# EAGLE design MAX232 to ATMega32 (EAGLE 9.6.0)
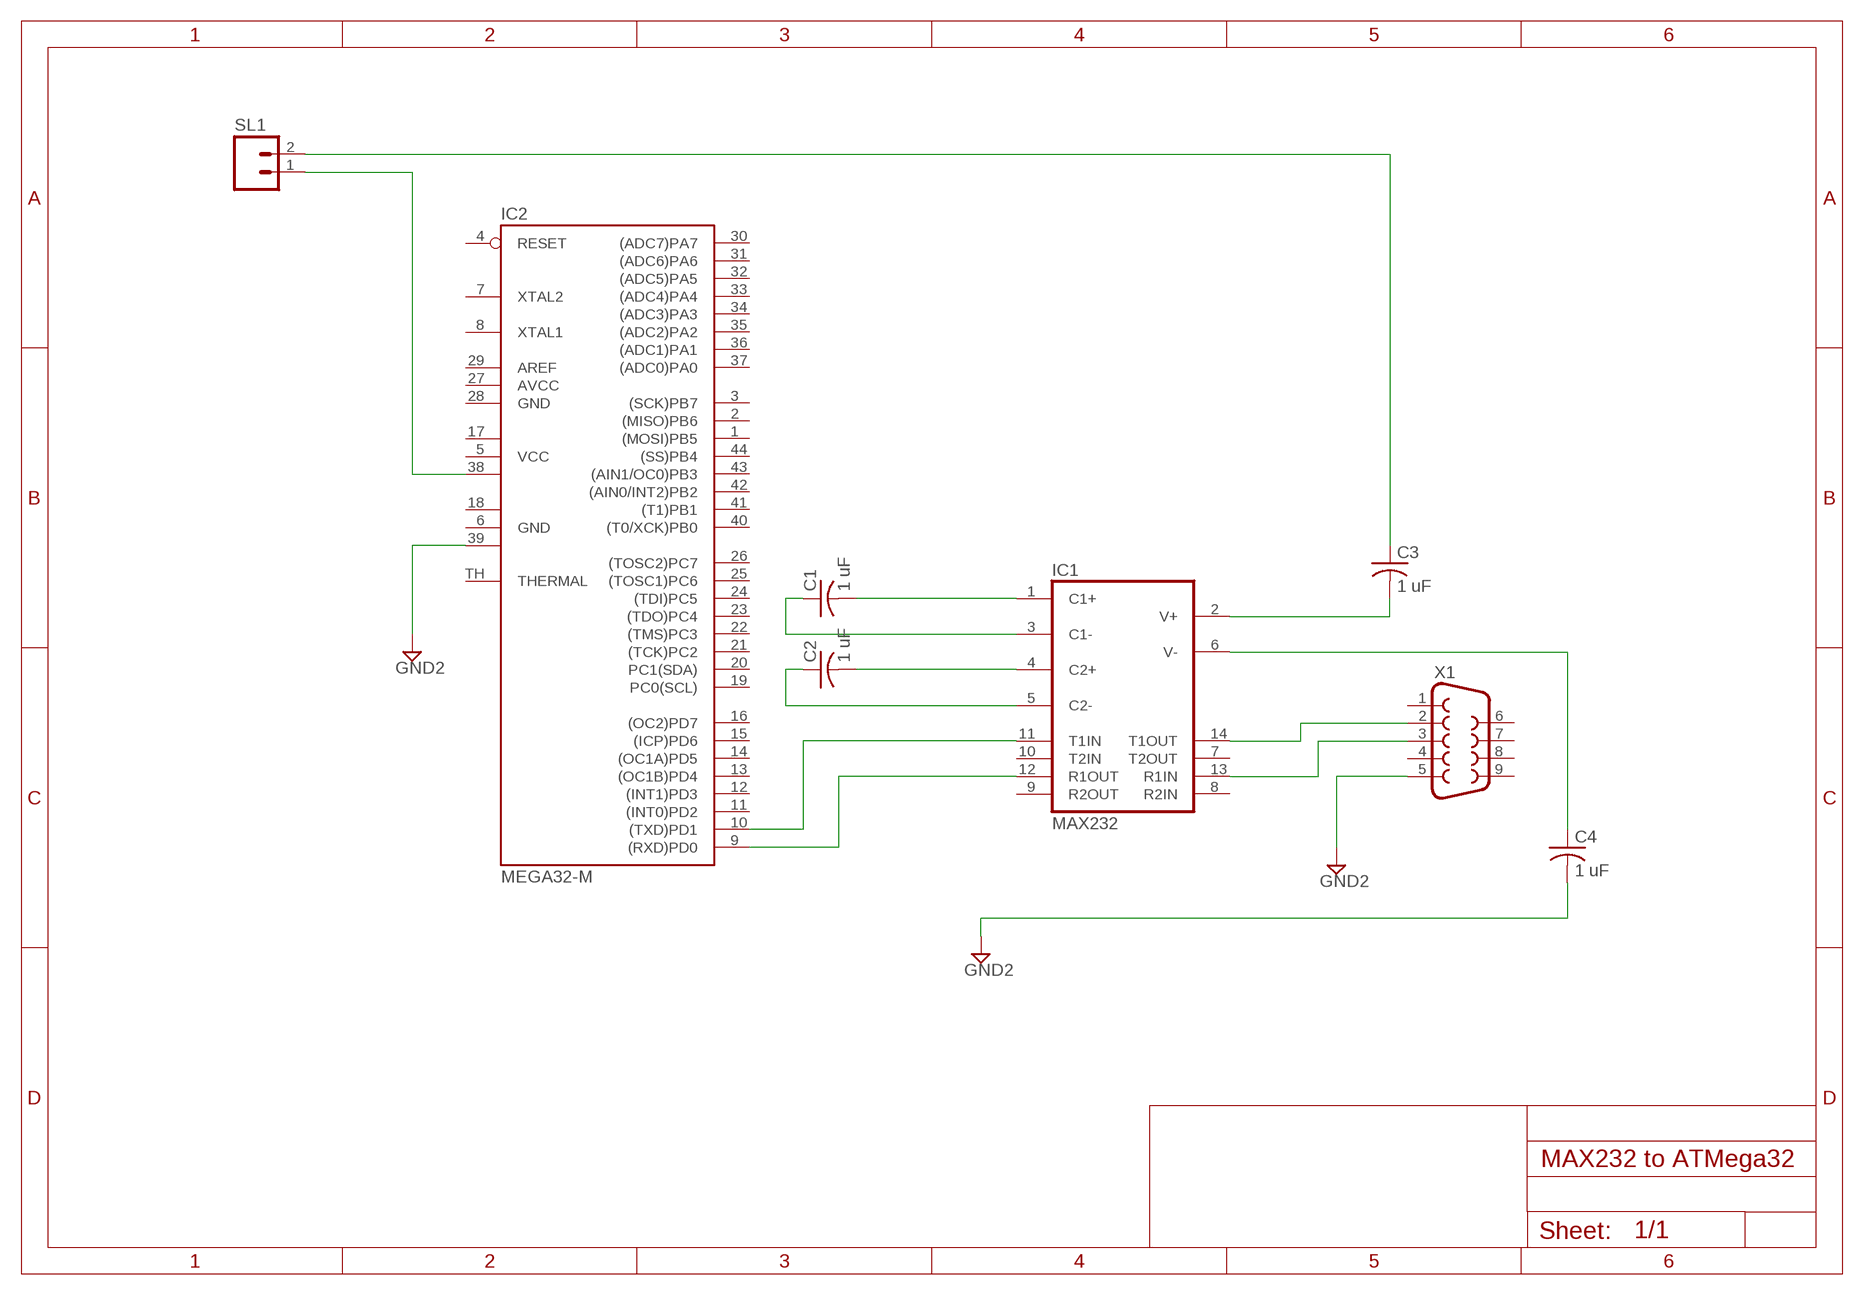
[diagram p0: schematic, sheet 1]

## Parts
C1  1 uF  C-US025-025X050  [C025-025X050]
C2  1 uF  C-US025-025X050  [C025-025X050]
C3  1 uF  C-US025-025X050  [C025-025X050]
C4  1 uF  C-US025-025X050  [C025-025X050]
IC1  MAX232  [DIL16]
IC2  MEGA32-M  [MLF44-TH]
SL1  M02  [02P]
X1  F09VB  [F09VB]

## Nets
GND2: C4.2 IC2.39(GND2) X1.5
N$1: IC1.14(T1OUT) X1.2
N$2: IC1.13(R1IN) X1.3
N$3: IC1.11(T1IN) IC2.10((TXD)PD1)
N$4: IC1.12(R1OUT) IC2.9((RXD)PD0)
N$5: C3.2 IC1.2(V+)
N$6: C4.1 IC1.6(V-)
N$7: C1.2 IC1.1(C1+)
N$8: C1.1 IC1.3(C1-)
N$9: C2.2 IC1.4(C2+)
N$10: C2.1 IC1.5(C2-)
N$12: C3.1 SL1.2
N$13: IC2.38(VCC2) SL1.1
Unconnected: IC1.7(T2OUT) IC1.8(R2IN) IC1.9(R2OUT) IC1.10(T2IN) IC2.1((MOSI)PB5) IC2.2((MISO)PB6) IC2.3((SCK)PB7) IC2.4(RESET) IC2.7(XTAL2) IC2.8(XTAL1) IC2.11((INT0)PD2) IC2.12((INT1)PD3) IC2.13((OC1B)PD4) IC2.14((OC1A)PD5) IC2.15((ICP)PD6) IC2.16((OC2)PD7) IC2.19(PC0(SCL)) IC2.20(PC1(SDA)) IC2.21((TCK)PC2) IC2.22((TMS)PC3) IC2.23((TDO)PC4) IC2.24((TDI)PC5) IC2.25((TOSC1)PC6) IC2.26((TOSC2)PC7) IC2.29(AREF) IC2.30((ADC7)PA7) IC2.31((ADC6)PA6) IC2.32((ADC5)PA5) IC2.33((ADC4)PA4) IC2.34((ADC3)PA3) IC2.35((ADC2)PA2) IC2.36((ADC1)PA1) IC2.37((ADC0)PA0) IC2.40((T0/XCK)PB0) IC2.41((T1)PB1) IC2.42((AIN0/INT2)PB2) IC2.43((AIN1/OC0)PB3) IC2.44((SS)PB4) IC2.TH(THERMAL) X1.1 X1.4 X1.6 X1.7 X1.8 X1.9

## Power pins joined to a net without a drawn wire
AVCC: IC2.27(AVCC)
GND: IC1.15(GND) IC2.6(GND) IC2.28(GND)
GND1: IC2.18(GND1)
VCC: IC1.16(VCC) IC2.5(VCC)
VCC1: IC2.17(VCC1)

## Library data of the parts
C1-C4 = adafruit:C-US: CAPACITOR, American symbol
IC1 = maxim:MAX232: RS232 TRANSCEIVER; MF: MAXIM; MPN: MAX232ACPE+; OC_FARNELL: 9723773; OC_NEWARK: 68K4544
IC2 = atmel:MEGA32-M: MICROCONTROLLER 32 Kbytes FLASH 2 Kbytes SRAM 1 Kbytes EEPROM USART 8-channel 10 bit ADC Source: www.atmel.com .. doc2503.pdf; MPN: ATMEGA32-16MU; OC_FARNELL: 1455108; OC_NEWARK: 58M3733
SL1 = con-amp-quick:M02: AMP QUICK CONNECTOR; OC_FARNELL: unknown; OC_NEWARK: unknown
X1 = con-subd:F09: SUB-D; OC_FARNELL: unknown; OC_NEWARK: unknown

## Board
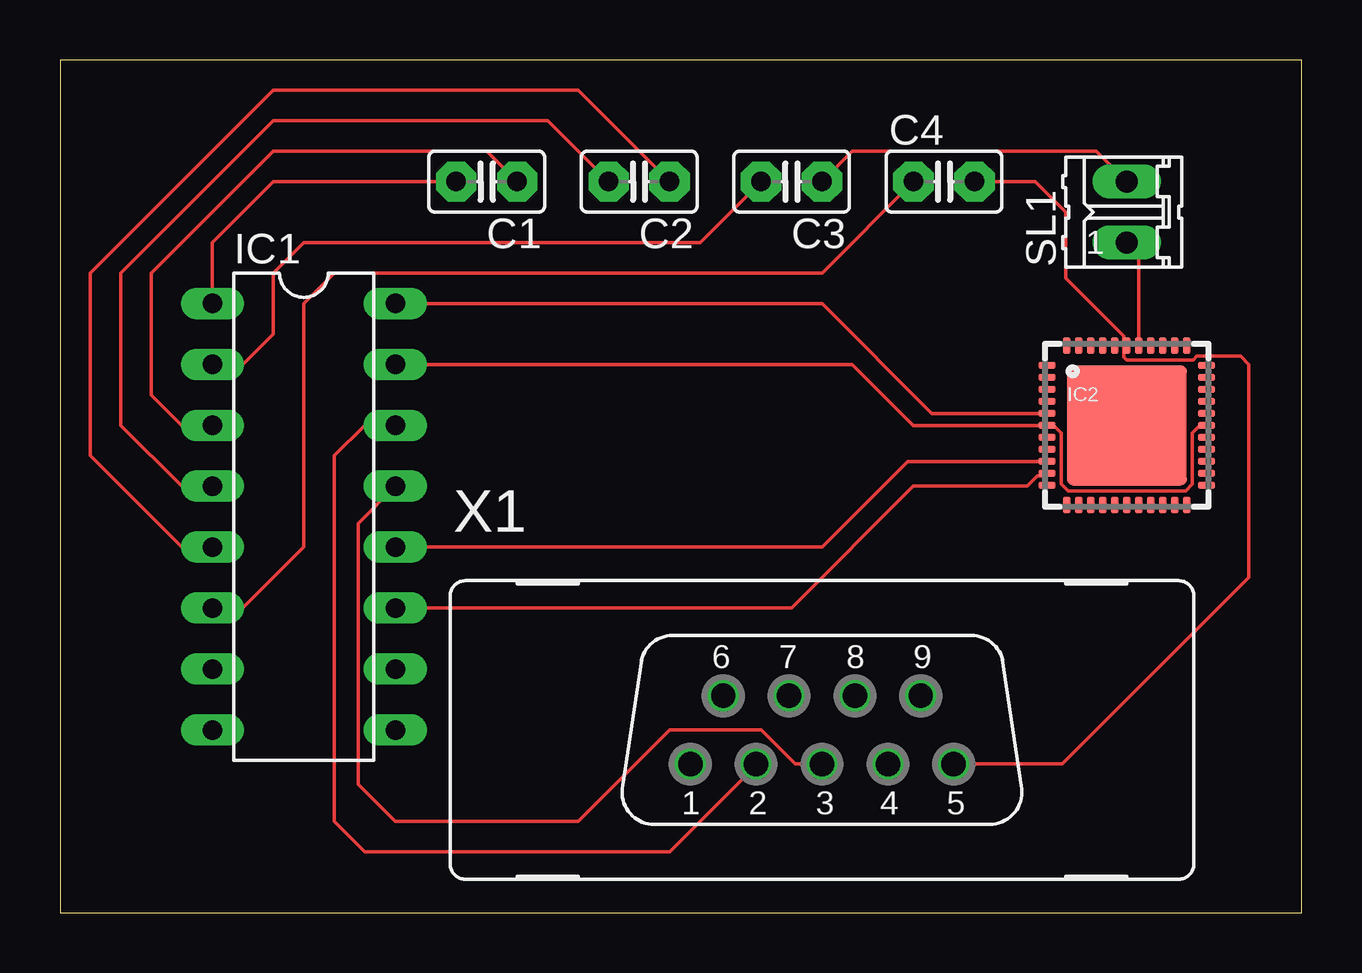
[diagram p1: board, top side]

Size 51.74 x 35.55 mm. Coordinates in mm from the lower left corner, seen from the top.
Outline: 0,0 51.74,0 51.74,35.55 0,35.55 0,0
Copper layers (1*16): Top 0.035mm / dielectric 1.5mm / Bottom 0.035mm
Design rules "default": minimum track width 6mil, minimum drill 0.35mm, track to track 6mil, track to pad 6mil, pad to pad 6mil, via to via 6mil, smd to smd 6mil, copper to edge 40mil, drill to drill 6mil, minimum pad ring 10mil, minimum via ring 8mil, stop-mask expansion 4mil, vias tented up to drill 0mil, thermal gap 10mil

### Footprints (pad centres in the part's own frame; a part is rotated, then mirrored left to right if it is on the bottom)
C025-025X050 = drill 0.813 pad 1.676 octagon: 1 -1.27,0; 2 1.27,0
DIL16 = drill 0.813 long: 1 -8.89,-3.81; 2 -6.35,-3.81; 3 -3.81,-3.81; 4 -1.27,-3.81; 5 1.27,-3.81; 6 3.81,-3.81; 7 6.35,-3.81; 8 8.89,-3.81; 9 8.89,3.81; 10 6.35,3.81; 11 3.81,3.81; 12 1.27,3.81; 13 -1.27,3.81; 14 -3.81,3.81; 15 -6.35,3.81; 16 -8.89,3.81
MLF44-TH = smd 0.7 x 0.3: 1 -3.325,2.5; 2 -3.325,2; 3 -3.325,1.5; 4 -3.325,1; 5 -3.325,0.5; 6 -3.325,0; 7 -3.325,-0.5; 8 -3.325,-1; 9 -3.325,-1.5; 10 -3.325,-2; 11 -3.325,-2.5; 23 3.325,-2.5; 24 3.325,-2; 25 3.325,-1.5; 26 3.325,-1; 27 3.325,-0.5; 28 3.325,0; 29 3.325,0.5; 30 3.325,1; 31 3.325,1.5; 32 3.325,2; 33 3.325,2.5 | smd 0.3 x 0.7: 12 -2.5,-3.325; 13 -2,-3.325; 14 -1.5,-3.325; 15 -1,-3.325; 16 -0.5,-3.325; 17 0,-3.325; 18 0.5,-3.325; 19 1,-3.325; 20 1.5,-3.325; 21 2,-3.325; 22 2.5,-3.325; 34 2.5,3.325; 35 2,3.325; 36 1.5,3.325; 37 1,3.325; 38 0.5,3.325; 39 0,3.325; 40 -0.5,3.325; 41 -1,3.325; 42 -1.5,3.325; 43 -2,3.325; 44 -2.5,3.325 | smd 5 x 5: TH 0,0
02P = drill 0.914 long: 1 -1.27,0; 2 1.27,0
F09VB = drill 1.016 octagon: 1 -5.486,-1.422; 2 -2.743,-1.422; 3 0,-1.422; 4 2.743,-1.422; 5 5.486,-1.422; 6 -4.115,1.422; 7 -1.372,1.422; 8 1.372,1.422; 9 4.115,1.422

### Placement (x,y rotation side)
C1  17.78,30.48 180 top
C2  24.13,30.48 180 top
C3  30.48,30.48 180 top
C4  36.83,30.48 0 top
IC1  10.16,16.51 270 top
IC2  44.45,20.32 0 top
SL1  44.45,29.21 90 top
X1  31.75,7.62 0 top

### Tracks (layer width: path | path; a pad name or v marks a point on that pad's centre or on a via)
GND
  Top 0.152: IC1.15 33.02,22.86 35.56,20.32 IC2.6 41.4,20.32 41.72,20 41.72,17.87 42,17.59 46.9,17.59 47.18,17.87 47.18,20 47.5,20.32 IC2.28
GND2
  Top 0.152: IC2.39 44.33,23.77 | 44.33,23.77 44.33,24.05 41.91,26.46 41.91,29.21 40.64,30.48 C4.2 | X1.5 41.76,6.2 49.53,13.97 49.53,22.86 49.19,23.2 47.37,23.2 47.22,23.05 44.45,23.05 44.33,23.17 44.33,23.77
N$1
  Top 0.152: X1.2 29.01,6.15 25.4,2.54 12.7,2.54 11.43,3.81 11.43,19.05 12.7,20.32 IC1.14
N$2
  Top 0.152: X1.3 30.63,6.2 29.21,7.62 25.4,7.62 21.59,3.81 13.97,3.81 12.42,5.36 12.42,16.23 IC1.13
N$3
  Top 0.152: IC2.10 41,18.2 40.72,18.2 40.31,17.78 35.56,17.78 30.48,12.7 IC1.11
N$4
  Top 0.152: IC2.9 35.33,18.82 31.75,15.24 IC1.12
N$5
  Top 0.152: C3.2 26.67,27.94 10.16,27.94 8.89,26.67 8.89,24.13 7.62,22.86 IC1.2
N$6
  Top 0.152: C4.1 31.75,26.67 11.43,26.67 10.16,25.4 10.16,15.24 7.62,12.7 IC1.6
N$7
  Top 0.152: IC1.1 6.35,27.94 8.89,30.48 C1.2
N$8
  Top 0.152: C1.1 17.78,31.75 8.89,31.75 3.81,26.67 3.81,21.59 5.08,20.32 IC1.3
N$9
  Top 0.152: C2.2 20.32,33.02 8.89,33.02 2.54,26.67 2.54,20.32 5.08,17.78 IC1.4
N$10
  Top 0.152: C2.1 21.59,34.29 8.89,34.29 1.27,26.67 1.27,19.05 5.08,15.24 IC1.5
N$12
  Top 0.152: SL1.2 43.18,31.75 33.02,31.75 C3.1
N$13
  Top 0.152: SL1.1 44.95,27.44 IC2.38
VCC
  Top 0.152: IC2.5 36.33,20.82 31.75,25.4 IC1.16